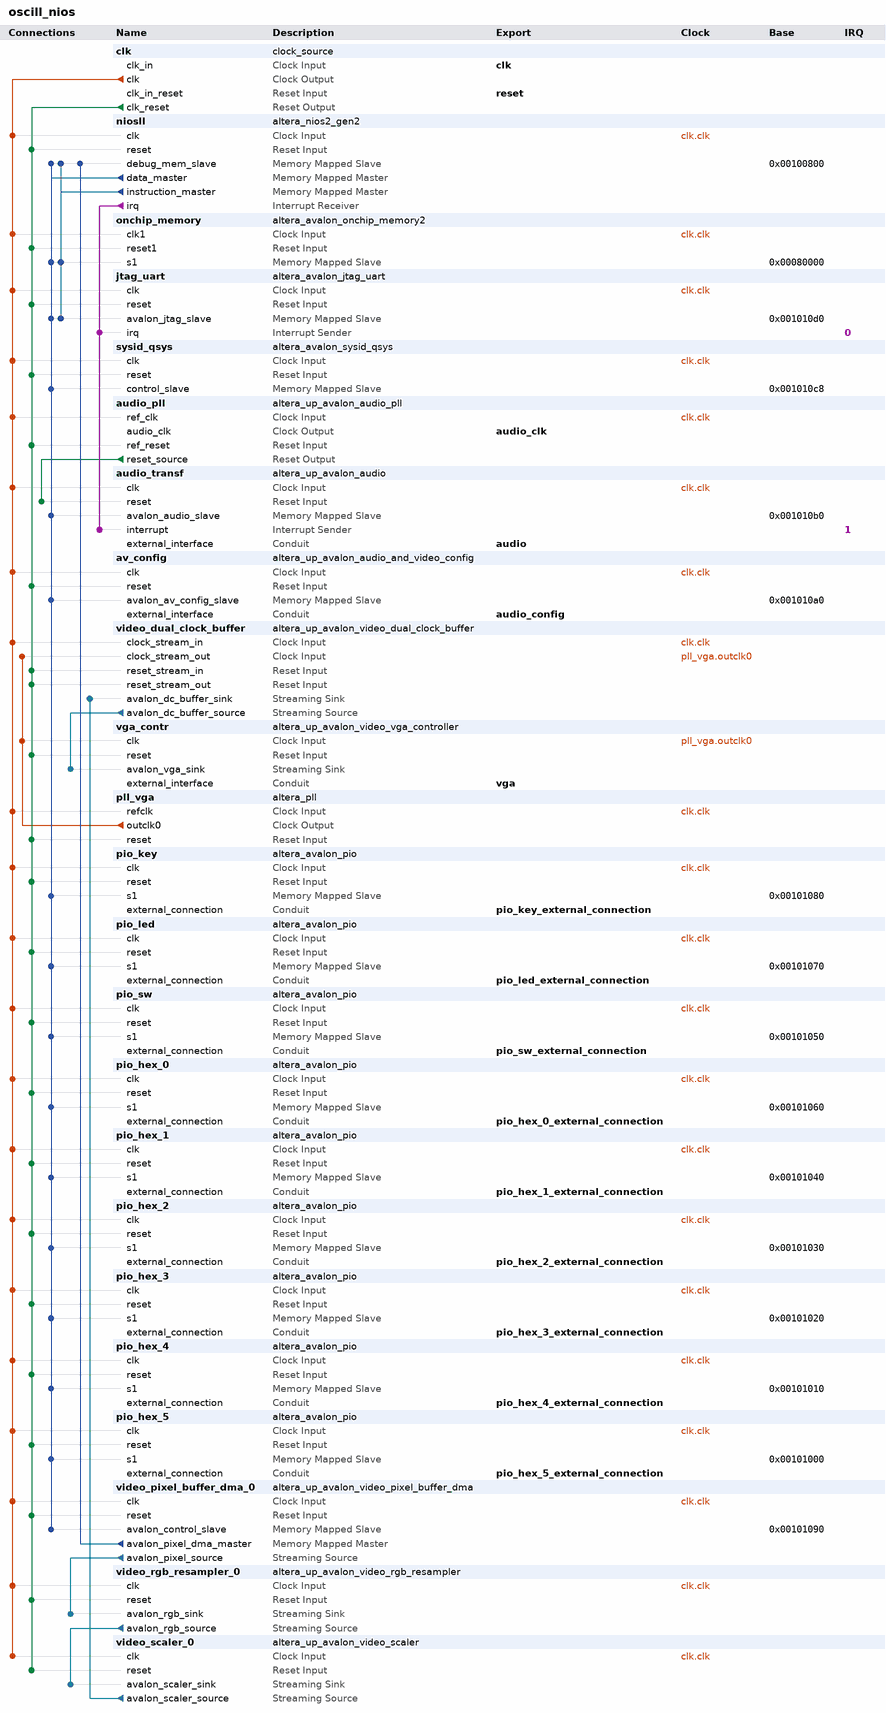
[diagram p0: system contents]
# Platform Designer (Qsys) system oscill_nios, Cyclone V 5CSEMA5F31C6
# Parameters at their usual value, and those the tool derives, are not listed.
package require -exact qsys 16.0
create_system oscill_nios
set_project_property DEVICE_FAMILY {Cyclone V}
set_project_property DEVICE 5CSEMA5F31C6

add_instance clk clock_source 16.0
set_instance_parameter_value clk clockFrequency 50000000

add_instance niosII altera_nios2_gen2 16.0
set_instance_parameter_value niosII dcache_size 2048
set_instance_parameter_value niosII exceptionSlave onchip_memory.s1
set_instance_parameter_value niosII icache_size 4096
set_instance_parameter_value niosII impl Fast
set_instance_parameter_value niosII resetSlave onchip_memory.s1
set_instance_parameter_value niosII setting_bhtPtrSz 12

add_instance onchip_memory altera_avalon_onchip_memory2 16.0
set_instance_parameter_value onchip_memory dataWidth 32
set_instance_parameter_value onchip_memory dualPort false
set_instance_parameter_value onchip_memory initMemContent true
set_instance_parameter_value onchip_memory initializationFileName onchip_mem.hex
set_instance_parameter_value onchip_memory memorySize 320000

add_instance jtag_uart altera_avalon_jtag_uart 16.0
set_instance_parameter_value jtag_uart simInteractiveOptions NO_INTERACTIVE_WINDOWS

add_instance sysid_qsys altera_avalon_sysid_qsys 16.0
set_instance_parameter_value sysid_qsys id 19088743

add_instance audio_pll altera_up_avalon_audio_pll 15.1
set_instance_parameter_value audio_pll gui_refclk 50.0

add_instance audio_transf altera_up_avalon_audio 15.1
set_instance_parameter_value audio_transf audio_in true
set_instance_parameter_value audio_transf avalon_bus_type {Memory Mapped}
set_instance_parameter_value audio_transf dw 16

add_instance av_config altera_up_avalon_audio_and_video_config 15.1
set_instance_parameter_value av_config audio_in {Line In to ADC}
set_instance_parameter_value av_config bit_length 16
set_instance_parameter_value av_config board DE1-SoC
set_instance_parameter_value av_config data_format {I2S Format}
set_instance_parameter_value av_config line_in_bypass true
set_instance_parameter_value av_config sampling_rate {48 kHz}

add_instance video_dual_clock_buffer altera_up_avalon_video_dual_clock_buffer 15.1
set_instance_parameter_value video_dual_clock_buffer color_bits 10

add_instance vga_contr altera_up_avalon_video_vga_controller 15.1
set_instance_parameter_value vga_contr board DE1-SoC
set_instance_parameter_value vga_contr resolution {VGA 640x480}

add_instance pll_vga altera_pll 16.0
set_instance_parameter_value pll_vga gui_device_speed_grade 1
set_instance_parameter_value pll_vga gui_number_of_clocks 1
set_instance_parameter_value pll_vga gui_operation_mode direct
set_instance_parameter_value pll_vga gui_output_clock_frequency0 25.0
set_instance_parameter_value pll_vga gui_pll_mode {Integer-N PLL}
set_instance_parameter_value pll_vga gui_reference_clock_frequency 50.0
set_instance_parameter_value pll_vga gui_use_locked false

add_instance pio_key altera_avalon_pio 16.0
set_instance_parameter_value pio_key direction Input
set_instance_parameter_value pio_key width 3

add_instance pio_led altera_avalon_pio 16.0
set_instance_parameter_value pio_led direction Output
set_instance_parameter_value pio_led width 10

add_instance pio_sw altera_avalon_pio 16.0
set_instance_parameter_value pio_sw direction Input
set_instance_parameter_value pio_sw width 10

add_instance pio_hex_0 altera_avalon_pio 16.0
set_instance_parameter_value pio_hex_0 direction Output
set_instance_parameter_value pio_hex_0 width 7

add_instance pio_hex_1 altera_avalon_pio 16.0
set_instance_parameter_value pio_hex_1 direction Output
set_instance_parameter_value pio_hex_1 width 7

add_instance pio_hex_2 altera_avalon_pio 16.0
set_instance_parameter_value pio_hex_2 direction Output
set_instance_parameter_value pio_hex_2 width 7

add_instance pio_hex_3 altera_avalon_pio 16.0
set_instance_parameter_value pio_hex_3 direction Output
set_instance_parameter_value pio_hex_3 width 7

add_instance pio_hex_4 altera_avalon_pio 16.0
set_instance_parameter_value pio_hex_4 direction Output
set_instance_parameter_value pio_hex_4 width 7

add_instance pio_hex_5 altera_avalon_pio 16.0
set_instance_parameter_value pio_hex_5 direction Output
set_instance_parameter_value pio_hex_5 width 7

add_instance video_pixel_buffer_dma_0 altera_up_avalon_video_pixel_buffer_dma 15.1
set_instance_parameter_value video_pixel_buffer_dma_0 addr_mode X-Y
set_instance_parameter_value video_pixel_buffer_dma_0 back_start_address 0
set_instance_parameter_value video_pixel_buffer_dma_0 color_space {8-bit RGB}
set_instance_parameter_value video_pixel_buffer_dma_0 image_height 120
set_instance_parameter_value video_pixel_buffer_dma_0 image_width 160
set_instance_parameter_value video_pixel_buffer_dma_0 start_address 393216

add_instance video_rgb_resampler_0 altera_up_avalon_video_rgb_resampler 15.1
set_instance_parameter_value video_rgb_resampler_0 alpha 1023
set_instance_parameter_value video_rgb_resampler_0 input_type {8-bit RGB}
set_instance_parameter_value video_rgb_resampler_0 output_type {30-bit RGB}

add_instance video_scaler_0 altera_up_avalon_video_scaler 15.1
set_instance_parameter_value video_scaler_0 color_bits 10
set_instance_parameter_value video_scaler_0 color_planes 3
set_instance_parameter_value video_scaler_0 height_in 120
set_instance_parameter_value video_scaler_0 height_scaling 4
set_instance_parameter_value video_scaler_0 width_in 160
set_instance_parameter_value video_scaler_0 width_scaling 4

# connections
add_connection clk.clk audio_pll.ref_clk clock
add_connection clk.clk audio_transf.clk clock
add_connection clk.clk av_config.clk clock
add_connection clk.clk jtag_uart.clk clock
add_connection clk.clk niosII.clk clock
add_connection clk.clk onchip_memory.clk1 clock
add_connection clk.clk pio_hex_0.clk clock
add_connection clk.clk pio_hex_1.clk clock
add_connection clk.clk pio_hex_2.clk clock
add_connection clk.clk pio_hex_3.clk clock
add_connection clk.clk pio_hex_4.clk clock
add_connection clk.clk pio_hex_5.clk clock
add_connection clk.clk pio_key.clk clock
add_connection clk.clk pio_led.clk clock
add_connection clk.clk pio_sw.clk clock
add_connection clk.clk pll_vga.refclk clock
add_connection clk.clk sysid_qsys.clk clock
add_connection clk.clk video_dual_clock_buffer.clock_stream_in clock
add_connection clk.clk video_pixel_buffer_dma_0.clk clock
add_connection clk.clk video_rgb_resampler_0.clk clock
add_connection clk.clk video_scaler_0.clk clock
add_connection pll_vga.outclk0 vga_contr.clk clock
add_connection pll_vga.outclk0 video_dual_clock_buffer.clock_stream_out clock
add_connection audio_pll.reset_source audio_transf.reset reset
add_connection clk.clk_reset audio_pll.ref_reset reset
add_connection clk.clk_reset av_config.reset reset
add_connection clk.clk_reset jtag_uart.reset reset
add_connection clk.clk_reset niosII.reset reset
add_connection clk.clk_reset onchip_memory.reset1 reset
add_connection clk.clk_reset pio_hex_0.reset reset
add_connection clk.clk_reset pio_hex_1.reset reset
add_connection clk.clk_reset pio_hex_2.reset reset
add_connection clk.clk_reset pio_hex_3.reset reset
add_connection clk.clk_reset pio_hex_4.reset reset
add_connection clk.clk_reset pio_hex_5.reset reset
add_connection clk.clk_reset pio_key.reset reset
add_connection clk.clk_reset pio_led.reset reset
add_connection clk.clk_reset pio_sw.reset reset
add_connection clk.clk_reset pll_vga.reset reset
add_connection clk.clk_reset sysid_qsys.reset reset
add_connection clk.clk_reset vga_contr.reset reset
add_connection clk.clk_reset video_dual_clock_buffer.reset_stream_in reset
add_connection clk.clk_reset video_dual_clock_buffer.reset_stream_out reset
add_connection clk.clk_reset video_pixel_buffer_dma_0.reset reset
add_connection clk.clk_reset video_rgb_resampler_0.reset reset
add_connection clk.clk_reset video_scaler_0.reset reset
add_connection niosII.data_master audio_transf.avalon_audio_slave avalon
set_connection_parameter_value niosII.data_master/audio_transf.avalon_audio_slave baseAddress 0x001010b0
add_connection niosII.data_master av_config.avalon_av_config_slave avalon
set_connection_parameter_value niosII.data_master/av_config.avalon_av_config_slave baseAddress 0x001010a0
add_connection niosII.data_master jtag_uart.avalon_jtag_slave avalon
set_connection_parameter_value niosII.data_master/jtag_uart.avalon_jtag_slave baseAddress 0x001010d0
add_connection niosII.data_master niosII.debug_mem_slave avalon
set_connection_parameter_value niosII.data_master/niosII.debug_mem_slave baseAddress 0x00100800
add_connection niosII.data_master onchip_memory.s1 avalon
set_connection_parameter_value niosII.data_master/onchip_memory.s1 baseAddress 0x00080000
add_connection niosII.data_master pio_hex_0.s1 avalon
set_connection_parameter_value niosII.data_master/pio_hex_0.s1 baseAddress 0x00101060
add_connection niosII.data_master pio_hex_1.s1 avalon
set_connection_parameter_value niosII.data_master/pio_hex_1.s1 baseAddress 0x00101040
add_connection niosII.data_master pio_hex_2.s1 avalon
set_connection_parameter_value niosII.data_master/pio_hex_2.s1 baseAddress 0x00101030
add_connection niosII.data_master pio_hex_3.s1 avalon
set_connection_parameter_value niosII.data_master/pio_hex_3.s1 baseAddress 0x00101020
add_connection niosII.data_master pio_hex_4.s1 avalon
set_connection_parameter_value niosII.data_master/pio_hex_4.s1 baseAddress 0x00101010
add_connection niosII.data_master pio_hex_5.s1 avalon
set_connection_parameter_value niosII.data_master/pio_hex_5.s1 baseAddress 0x00101000
add_connection niosII.data_master pio_key.s1 avalon
set_connection_parameter_value niosII.data_master/pio_key.s1 baseAddress 0x00101080
add_connection niosII.data_master pio_led.s1 avalon
set_connection_parameter_value niosII.data_master/pio_led.s1 baseAddress 0x00101070
add_connection niosII.data_master pio_sw.s1 avalon
set_connection_parameter_value niosII.data_master/pio_sw.s1 baseAddress 0x00101050
add_connection niosII.data_master sysid_qsys.control_slave avalon
set_connection_parameter_value niosII.data_master/sysid_qsys.control_slave baseAddress 0x001010c8
add_connection niosII.data_master video_pixel_buffer_dma_0.avalon_control_slave avalon
set_connection_parameter_value niosII.data_master/video_pixel_buffer_dma_0.avalon_control_slave baseAddress 0x00101090
add_connection niosII.instruction_master jtag_uart.avalon_jtag_slave avalon
set_connection_parameter_value niosII.instruction_master/jtag_uart.avalon_jtag_slave baseAddress 0x001010d0
add_connection niosII.instruction_master niosII.debug_mem_slave avalon
set_connection_parameter_value niosII.instruction_master/niosII.debug_mem_slave baseAddress 0x00100800
add_connection niosII.instruction_master onchip_memory.s1 avalon
set_connection_parameter_value niosII.instruction_master/onchip_memory.s1 baseAddress 0x00080000
add_connection video_pixel_buffer_dma_0.avalon_pixel_dma_master niosII.debug_mem_slave avalon
set_connection_parameter_value video_pixel_buffer_dma_0.avalon_pixel_dma_master/niosII.debug_mem_slave baseAddress 0x00100800
add_connection video_dual_clock_buffer.avalon_dc_buffer_source vga_contr.avalon_vga_sink avalon_streaming
add_connection video_pixel_buffer_dma_0.avalon_pixel_source video_rgb_resampler_0.avalon_rgb_sink avalon_streaming
add_connection video_rgb_resampler_0.avalon_rgb_source video_scaler_0.avalon_scaler_sink avalon_streaming
add_connection video_scaler_0.avalon_scaler_source video_dual_clock_buffer.avalon_dc_buffer_sink avalon_streaming
add_connection niosII.irq audio_transf.interrupt interrupt
set_connection_parameter_value niosII.irq/audio_transf.interrupt irqNumber 1
add_connection niosII.irq jtag_uart.irq interrupt
set_connection_parameter_value niosII.irq/jtag_uart.irq irqNumber 0

# exported interfaces
add_interface audio conduit end
set_interface_property audio EXPORT_OF audio_transf.external_interface
add_interface audio_clk clock source
set_interface_property audio_clk EXPORT_OF audio_pll.audio_clk
add_interface audio_config conduit end
set_interface_property audio_config EXPORT_OF av_config.external_interface
add_interface clk clock sink
set_interface_property clk EXPORT_OF clk.clk_in
add_interface pio_hex_0_external_connection conduit end
set_interface_property pio_hex_0_external_connection EXPORT_OF pio_hex_0.external_connection
add_interface pio_hex_1_external_connection conduit end
set_interface_property pio_hex_1_external_connection EXPORT_OF pio_hex_1.external_connection
add_interface pio_hex_2_external_connection conduit end
set_interface_property pio_hex_2_external_connection EXPORT_OF pio_hex_2.external_connection
add_interface pio_hex_3_external_connection conduit end
set_interface_property pio_hex_3_external_connection EXPORT_OF pio_hex_3.external_connection
add_interface pio_hex_4_external_connection conduit end
set_interface_property pio_hex_4_external_connection EXPORT_OF pio_hex_4.external_connection
add_interface pio_hex_5_external_connection conduit end
set_interface_property pio_hex_5_external_connection EXPORT_OF pio_hex_5.external_connection
add_interface pio_key_external_connection conduit end
set_interface_property pio_key_external_connection EXPORT_OF pio_key.external_connection
add_interface pio_led_external_connection conduit end
set_interface_property pio_led_external_connection EXPORT_OF pio_led.external_connection
add_interface pio_sw_external_connection conduit end
set_interface_property pio_sw_external_connection EXPORT_OF pio_sw.external_connection
add_interface reset reset sink
set_interface_property reset EXPORT_OF clk.clk_in_reset
add_interface vga conduit end
set_interface_property vga EXPORT_OF vga_contr.external_interface

set_interconnect_requirement {$system} qsys_mm.clockCrossingAdapter HANDSHAKE
set_interconnect_requirement {$system} qsys_mm.enableEccProtection FALSE
set_interconnect_requirement {$system} qsys_mm.insertDefaultSlave FALSE
set_interconnect_requirement {$system} qsys_mm.maxAdditionalLatency 1

save_system oscill_nios.qsys
